# Altium schematic sheet Sheet2.SchDoc
size A3; CompanyName: 瀬沼電子; Organization: 瀬沼電子; Address1: 〒197-0827; Address2: 東京都あきる野; Address3: 油平259; Phone: 042-558-0141; Rule: PcbType=ProtelPcb
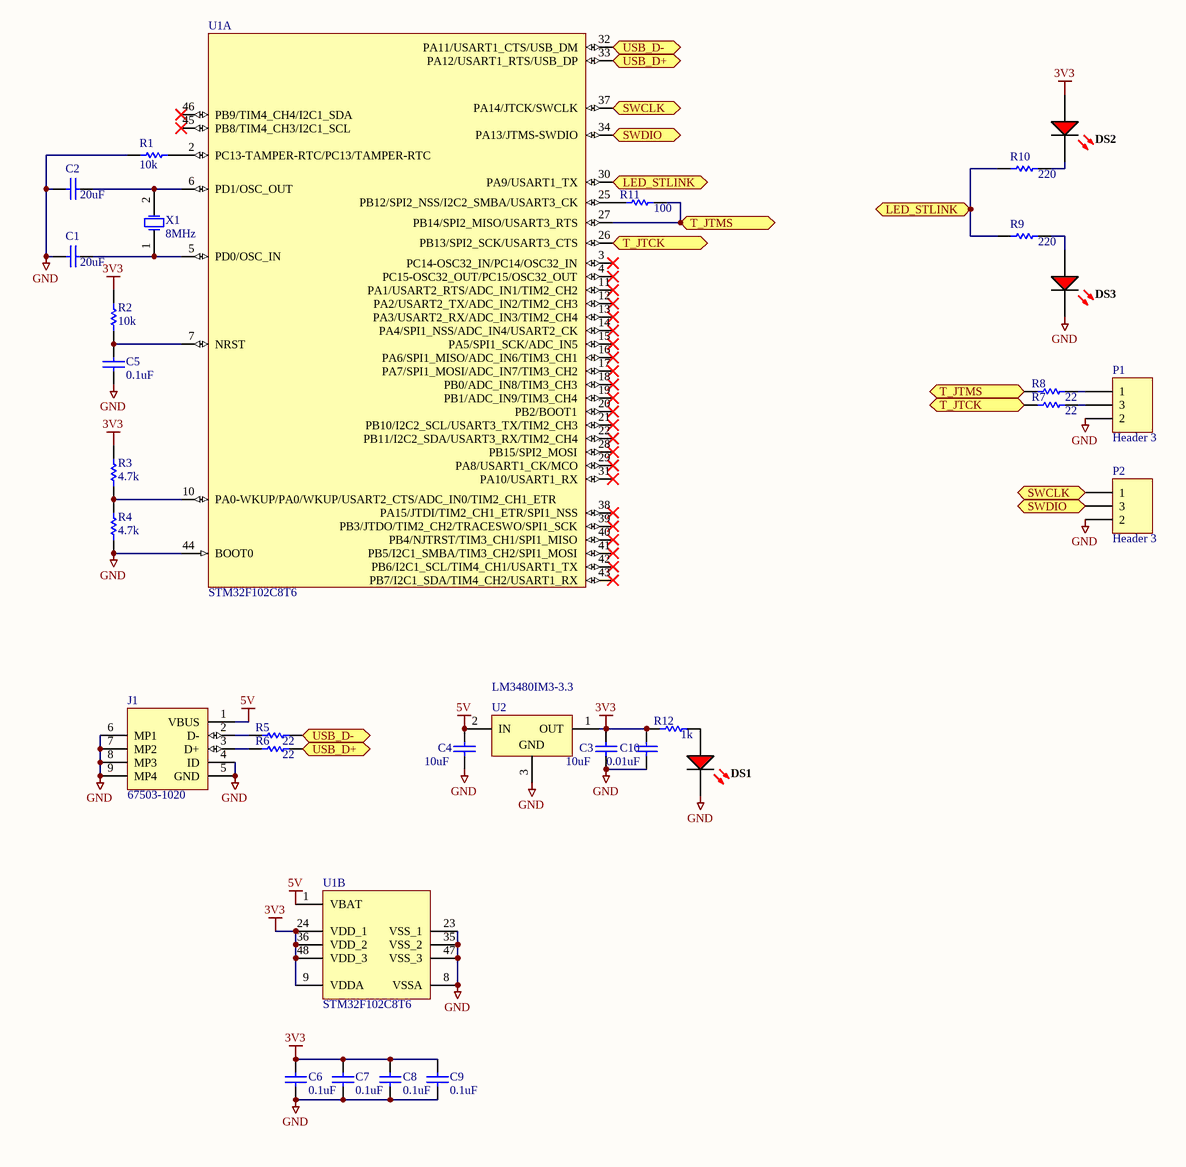
[diagram p0: Sheet2.SchDoc]

## Parts
C1  value 20uF  [CAPC0603(1608)100_N]  (hidden comment: CAP 6.8uF 6.3V 0603(1608))
C2  value 20uF  [CAPC0603(1608)100_N]  (hidden comment: CAP 6.8uF 6.3V 0603(1608))
C3  value 10uF  [CAPC0603(1608)100_M]  (hidden comment: CAP 0.1uF 6.3V 0603(1608))
C4  value 10uF  [CAPC0603(1608)100_M]  (hidden comment: CAP 0.1uF 6.3V 0603(1608))
C5  value 0.1uF  [CAPC0603(1608)100_M]  (hidden comment: CAP 0.1uF 6.3V 0603(1608))
C6  value 0.1uF  [CAPC0603(1608)100_M]  (hidden comment: CAP 0.1uF 6.3V 0603(1608))
C7  value 0.1uF  [CAPC0603(1608)100_M]  (hidden comment: CAP 0.1uF 6.3V 0603(1608))
C8  value 0.1uF  [CAPC0603(1608)100_M]  (hidden comment: CAP 0.1uF 6.3V 0603(1608))
C9  value 0.1uF  [CAPC0603(1608)100_M]  (hidden comment: CAP 0.1uF 6.3V 0603(1608))
C10  value 0.01uF  [CAPC0603(1608)100_M]  (hidden comment: CAP 0.1uF 6.3V 0603(1608))
DS1  APG1608SURKC/T  [KING-LED0603-25-RED_V]  (value not drawn)
DS2  APG1608SURKC/T  [KING-LED0603-25-RED_V]  (value not drawn)
DS3  APG1608SURKC/T  [KING-LED0603-25-RED_V]  (value not drawn)
J1  67503-1020  [MOLX-67503-1020_V]
P1  Header 3  [HDR1X3]
P2  Header 3  [HDR1X3]
R1  10k  [RESC0603(1608)_N]
R2  10k  [RESC0603(1608)_N]
R3  4.7k  [RESC0603(1608)_N]
R4  4.7k  [RESC0603(1608)_N]
R5  22  [RESC0603(1608)_N]
R6  22  [RESC0603(1608)_N]
R7  22  [RESC0603(1608)_N]
R8  22  [RESC0603(1608)_N]
R9  220  [RESC0603(1608)_N]
R10  220  [RESC0603(1608)_N]
R11  100  [RESC0603(1608)_N]
R12  1k  [RESC0603(1608)_N]
U1  STM32F102C8T6  [STM-LQFP48_N]  (parts A,B of 2)
U2  LM3480IM3-3.3  [MF03A_L]
X1  8MHz  [ABRA-ABLS2-2_V]

## Ports
LED_STLINK, SWCLK (out), SWDIO (bidir), T_JTCK, T_JTMS, USB_D+, USB_D+ (bidir), USB_D-, USB_D- (bidir)

## Nets
3V3: C3.2 C6.2 C7.1 C8.1 C9.1 C10.2 DS2.1(A) R2.2 R3.2 R12.1 U1.9(VDDA) U1.24(VDD_1) U1.36(VDD_2) U1.48(VDD_3) U2.1(OUT)
5V: C4.2 J1.1(VBUS) U1.1(VBAT) U2.2(IN)
GND: C1.1 C2.1 C3.1 C4.1 C5.2 C6.1 C7.2 C8.2 C9.2 C10.1 DS1.2(K) DS3.2(K) J1.4(ID) J1.5(GND) J1.6(MP1) J1.7(MP2) J1.8(MP3) J1.9(MP4) P1.2 P2.2 R1.1 R4.1 U1.8(VSSA) U1.23(VSS_1) U1.35(VSS_2) U1.44(BOOT0) U1.47(VSS_3) U2.3(GND)
LED_STLINK: R9.2 R10.2 U1.30(PA9/USART1_TX) ; port LED_STLINK
SWCLK: P2.1 U1.37(PA14/JTCK/SWCLK) ; port SWCLK
SWDIO: P2.3 U1.34(PA13/JTMS-SWDIO) ; port SWDIO
T_JTCK: R7.2 U1.26(PB13/SPI2_SCK/USART3_CTS) ; port T_JTCK
T_JTMS: R8.2 R11.1 U1.27(PB14/SPI2_MISO/USART3_RTS) ; port T_JTMS
USB_D+: R6.2 U1.33(PA12/USART1_RTS/USB_DP) ; port USB_D+
USB_D-: R5.2 U1.32(PA11/USART1_CTS/USB_DM) ; port USB_D-
NetC1_2: C1.2 U1.5(PD0/OSC_IN) X1.1(X1)
NetC2_2: C2.2 U1.6(PD1/OSC_OUT) X1.2(X2)
NetC5_1: C5.1 R2.1 U1.7(NRST)
NetDS1_1: DS1.1(A) R12.2
NetDS2_2: DS2.2(K) R10.1
NetDS3_1: DS3.1(A) R9.1
NetJ1_2: J1.2(D-) R5.1
NetJ1_3: J1.3(D+) R6.1
NetP1_1: P1.1 R8.1
NetP1_3: P1.3 R7.1
NetR1_2: R1.2 U1.2(PC13-TAMPER-RTC/PC13/TAMPER-RTC)
NetR3_1: R3.1 R4.2 U1.10(PA0-WKUP/PA0/WKUP/USART2_CTS/ADC_IN0/TIM2_CH1_ETR)
NetR11_2: R11.2 U1.25(PB12/SPI2_NSS/I2C2_SMBA/USART3_CK)

Not connected (* = marked no-connect by the designer): U1 3(PC14-OSC32_IN/PC14/OSC32_IN)* 4(PC15-OSC32_OUT/PC15/OSC32_OUT)* 11(PA1/USART2_RTS/ADC_IN1/TIM2_CH2)* 12(PA2/USART2_TX/ADC_IN2/TIM2_CH3)* 13(PA3/USART2_RX/ADC_IN3/TIM2_CH4)* 14(PA4/SPI1_NSS/ADC_IN4/USART2_CK)* 15(PA5/SPI1_SCK/ADC_IN5)* 16(PA6/SPI1_MISO/ADC_IN6/TIM3_CH1)* 17(PA7/SPI1_MOSI/ADC_IN7/TIM3_CH2)* 18(PB0/ADC_IN8/TIM3_CH3)* 19(PB1/ADC_IN9/TIM3_CH4)* 20(PB2/BOOT1)* 21(PB10/I2C2_SCL/USART3_TX/TIM2_CH3)* 22(PB11/I2C2_SDA/USART3_RX/TIM2_CH4)* 28(PB15/SPI2_MOSI)* 29(PA8/USART1_CK/MCO)* 31(PA10/USART1_RX)* 38(PA15/JTDI/TIM2_CH1_ETR/SPI1_NSS)* 39(PB3/JTDO/TIM2_CH2/TRACESWO/SPI1_SCK)* 40(PB4/NJTRST/TIM3_CH1/SPI1_MISO)* 41(PB5/I2C1_SMBA/TIM3_CH2/SPI1_MOSI)* 42(PB6/I2C1_SCL/TIM4_CH1/USART1_TX)* 43(PB7/I2C1_SDA/TIM4_CH2/USART1_RX)* 45(PB8/TIM4_CH3/I2C1_SCL)* 46(PB9/TIM4_CH4/I2C1_SDA)*

## Notes on the sheet
- Title:
- A3
- Designer:
- Company:
- Revisions:
- Notes:
- Dept.:
- Email:
- File:
- rev:
- sheet:
- of
- Marked:

## Library data of the parts
C1 C2 = CMP-1035-02791-1: CAP 6.8uF 6.3V Â±20% 0603 (1608 Metric) Thickness 1mm SMD; Case-EIA: 0603; Case-Metric: 1608; Tolerance: Â±20%; Max Thickness: 1 mm; Technology: SMT; Rated Voltage: 6.3 V
C3-C10 = CMP-1035-01870-1: CAP 0.1uF 6.3V Â±20% 0603 (1608 Metric) Thickness 1mm SMD; Case-Metric: 1608; Case-EIA: 0603; Max Thickness: 1 mm; Rated Voltage: 6.3 V; Technology: SMT; Tolerance: Â±20%
DS1-DS3 = CMP-0404-00004-1: Ultra Thin Hyper Red SMD Chip LED Lamp, 2 to 2.5 V, -40 to 85 degC, Body 1.6 x 0.8 mm, 0.28 mm Thickness, RoHS, Tape and Reel; Manufacturer: Kingbright; Dice: Hyper Red (AlGaInP); IR (Max): 10 uA; Luminous Intensity mcd @ 20 mA (Min.): 55; Lens Type: Water Clear; Viewing Angle: 120; Luminous Intensity mcd @ 20 mA (Typ.): 110; ComponentLink2Description: Datasheet; ComponentLink3URL: http://www.kingbrightusa.com/images/catalog/SPEC/APG1608SURKC-T.pdf; Packing: Tape and Reel; Mounting Technology: Surface Mount; PackageVersion: Rev. V.5A; ComponentLink1Description: Manufacturer URL; ComponentLink2URL: http://www.kingbrightusa.com/images/catalog/SPEC/APG1608SURKC-T.pdf; ComponentLink3Description: Package Specification; PackageDescription: 2-Pin SMT, Body 1.6 x 0.8 mm, 0.28mm Thickness, Red; PackageReference: LED0603-25-RED; DatasheetVersion: Rev. V.5A; Operating Temperature: -40 to 85 degC; PartNumber: APG1608SURKC/T; ComponentLink1URL: http://www.kingbrightusa.com/; Forward Voltage: 2 to 2.5 V; RoHS: TRUE
J1 = CMP-0411-00002-1: USB, MINI, SMD, RA KME04-USBMU03A01; Manufacturer: Molex; ComponentLink1URL: http://www.molex.com/; PartNumber: 67503-1020; Mounting Technology: Surface Mount; ComponentLink1Description: Manufacturer URL; Terminal Pitch: 0.8 mm; DatasheetVersion: Rev F, 06/2009; ComponentLink2Description: Datasheet; PackageDescription: Mini USB Connector, SMT, Righer Angle; ComponentLink2URL: http://www.molex.com/pdm_docs/sd/675031020_sd.pdf; PackageReference: 67503-1020
P1 P2 = Header 3: Header, 3-Pin; LatestRevisionDate: 17-Jul-2002; LatestRevisionNote: Re-released for DXP Platform.; Publisher: Altium Limited
R1-R12 = CMP-1012-00514-1: 10K 0.1W 1% 0603 (1608 Metric)  SMD; Case-Metric: 1608; Case-EIA: 0603; Technology: SMT; Tolerance: 1 %; Power: 0.1 W
  R1 R2: Value: 10k
  R3 R4: Value: 4.7k
  R5-R8: Value: 22
  R9 R10: Value: 220
  R11: Value: 100
  R12: Value: 1k
U1 = CMP-0237-00173-2: ARM Cortex-M3 32-bit MCU, 64 KB Flash, 10 KB Internal RAM, 37 I/Os, 48-pin LQFP, -40 to 85 degC, Tray; Operating Frequency(F) (Processor speed) (MHz): 48; I/Os (High Current): 37; A/D Converter: 1x12-bit (10 Channel); Supply Voltage(Vcc) min (V): 2; Internal RAM Size (kB): 10; FLASH Size (Prog) (kB): 64; ComponentLink2Description: Datasheet; PartNumber: STM32F102C8T6; PackageReference: LQFP48; ComponentLink3URL: http://www.st.com/st-web-ui/static/active/en/resource/technical/document/datasheet/DM00058181.pdf; ComponentLink3Description: Package Specification; PackageDescription: 48-Pin Low Profile Quad Flat Package, 7 x 7 mm Body, 0.5 mm Pitch; Mounting Technology: Surface Mount; PackageVersion: Rev. 6, 06/2013; DatasheetVersion: Rev. 5; ComponentLink1URL: http://www.st.com/web/en/home.html; ComponentLink1Description: Manufacturer URL; Packing: Tray; ComponentLink2URL: http://www.st.com/st-web-ui/static/active/en/resource/technical/document/datasheet/CD00210831.pdf; Core: ARM Cortex-M3; PartId: 1
U2 = CMP-0062-02201-2: 100 mA, Quasi Low-Dropout Linear Voltage Regulator, 3-pin SOT-23; Manufacturer: National Semiconductor; CompType: LDO IC; PackageTopMarking: L0A*XTT; PowerWise: N; RoHS: N; PackageReference: MF03A; DatasheetVersion: Mar-2005; PackageVersion: revB, Mar-2003; ComponentLink2URL: http://www.national.com/pf/LM/LM3480.html; ComponentLink2Description: LM3480 Web Page; PinCount: 3; RevisionNote: Component URLs added; ComponentLink3Description: MF03A Package Page; ComponentLink1URL: http://www.national.com/ds/LM/LM3480.pdf; PackageDescription: Molded SOT-23, .115 x .051 x .037in Body, 3 Lead, .075 in Pitch; ComponentLink3URL: http://www.national.com/packaging/folders/mf03a.html; ComponentLink1Description: LM3480 Datasheet
X1 = CMP-0277-00002-1: Low Profile Surface Mount Microprocessor Crystal, 4.096 MHz +/-30 ppm, 180 Ohm, -40 to 85 degC, 2-Pin 11.4 x 4.7 x 3.3 mm SMD, RoHS, Tape and Reel; Manufacturer: Abracon; PartNumber: ABLS2-4.096MHZ-D4Y-T; Operation Mode: Fundamental or 3rd Overtone; Shunt Capacitance: 7 pF Max.; ESR: 180 Ohm; Load Capacitance: 18 pF; Mounting Technology: Surface Mount; PackageDescription: 2-Pin SMD, Body 11.4 x 4.7 mm, Height 3.3 mm; ComponentLink1URL: http://www.abracon.com/; Freq. Stability: +/- 30 ppm; ComponentLink2Description: Datasheet; Operating Temp. Range: -40 to 85 degC; Packing: Tape and Reel; RoHS: TRUE; PackageReference: ABLS2-2; DatasheetVersion: Rev. 03.31.11; Freq. Tolerance: +/- 30 ppm; Frequency: 8MHz; ComponentLink2URL: http://www.abracon.com/Resonators/ABLS2.pdf; ComponentLink1Description: Manufacturer URL